# EAGLE design dboard (EAGLE 9.6.2)
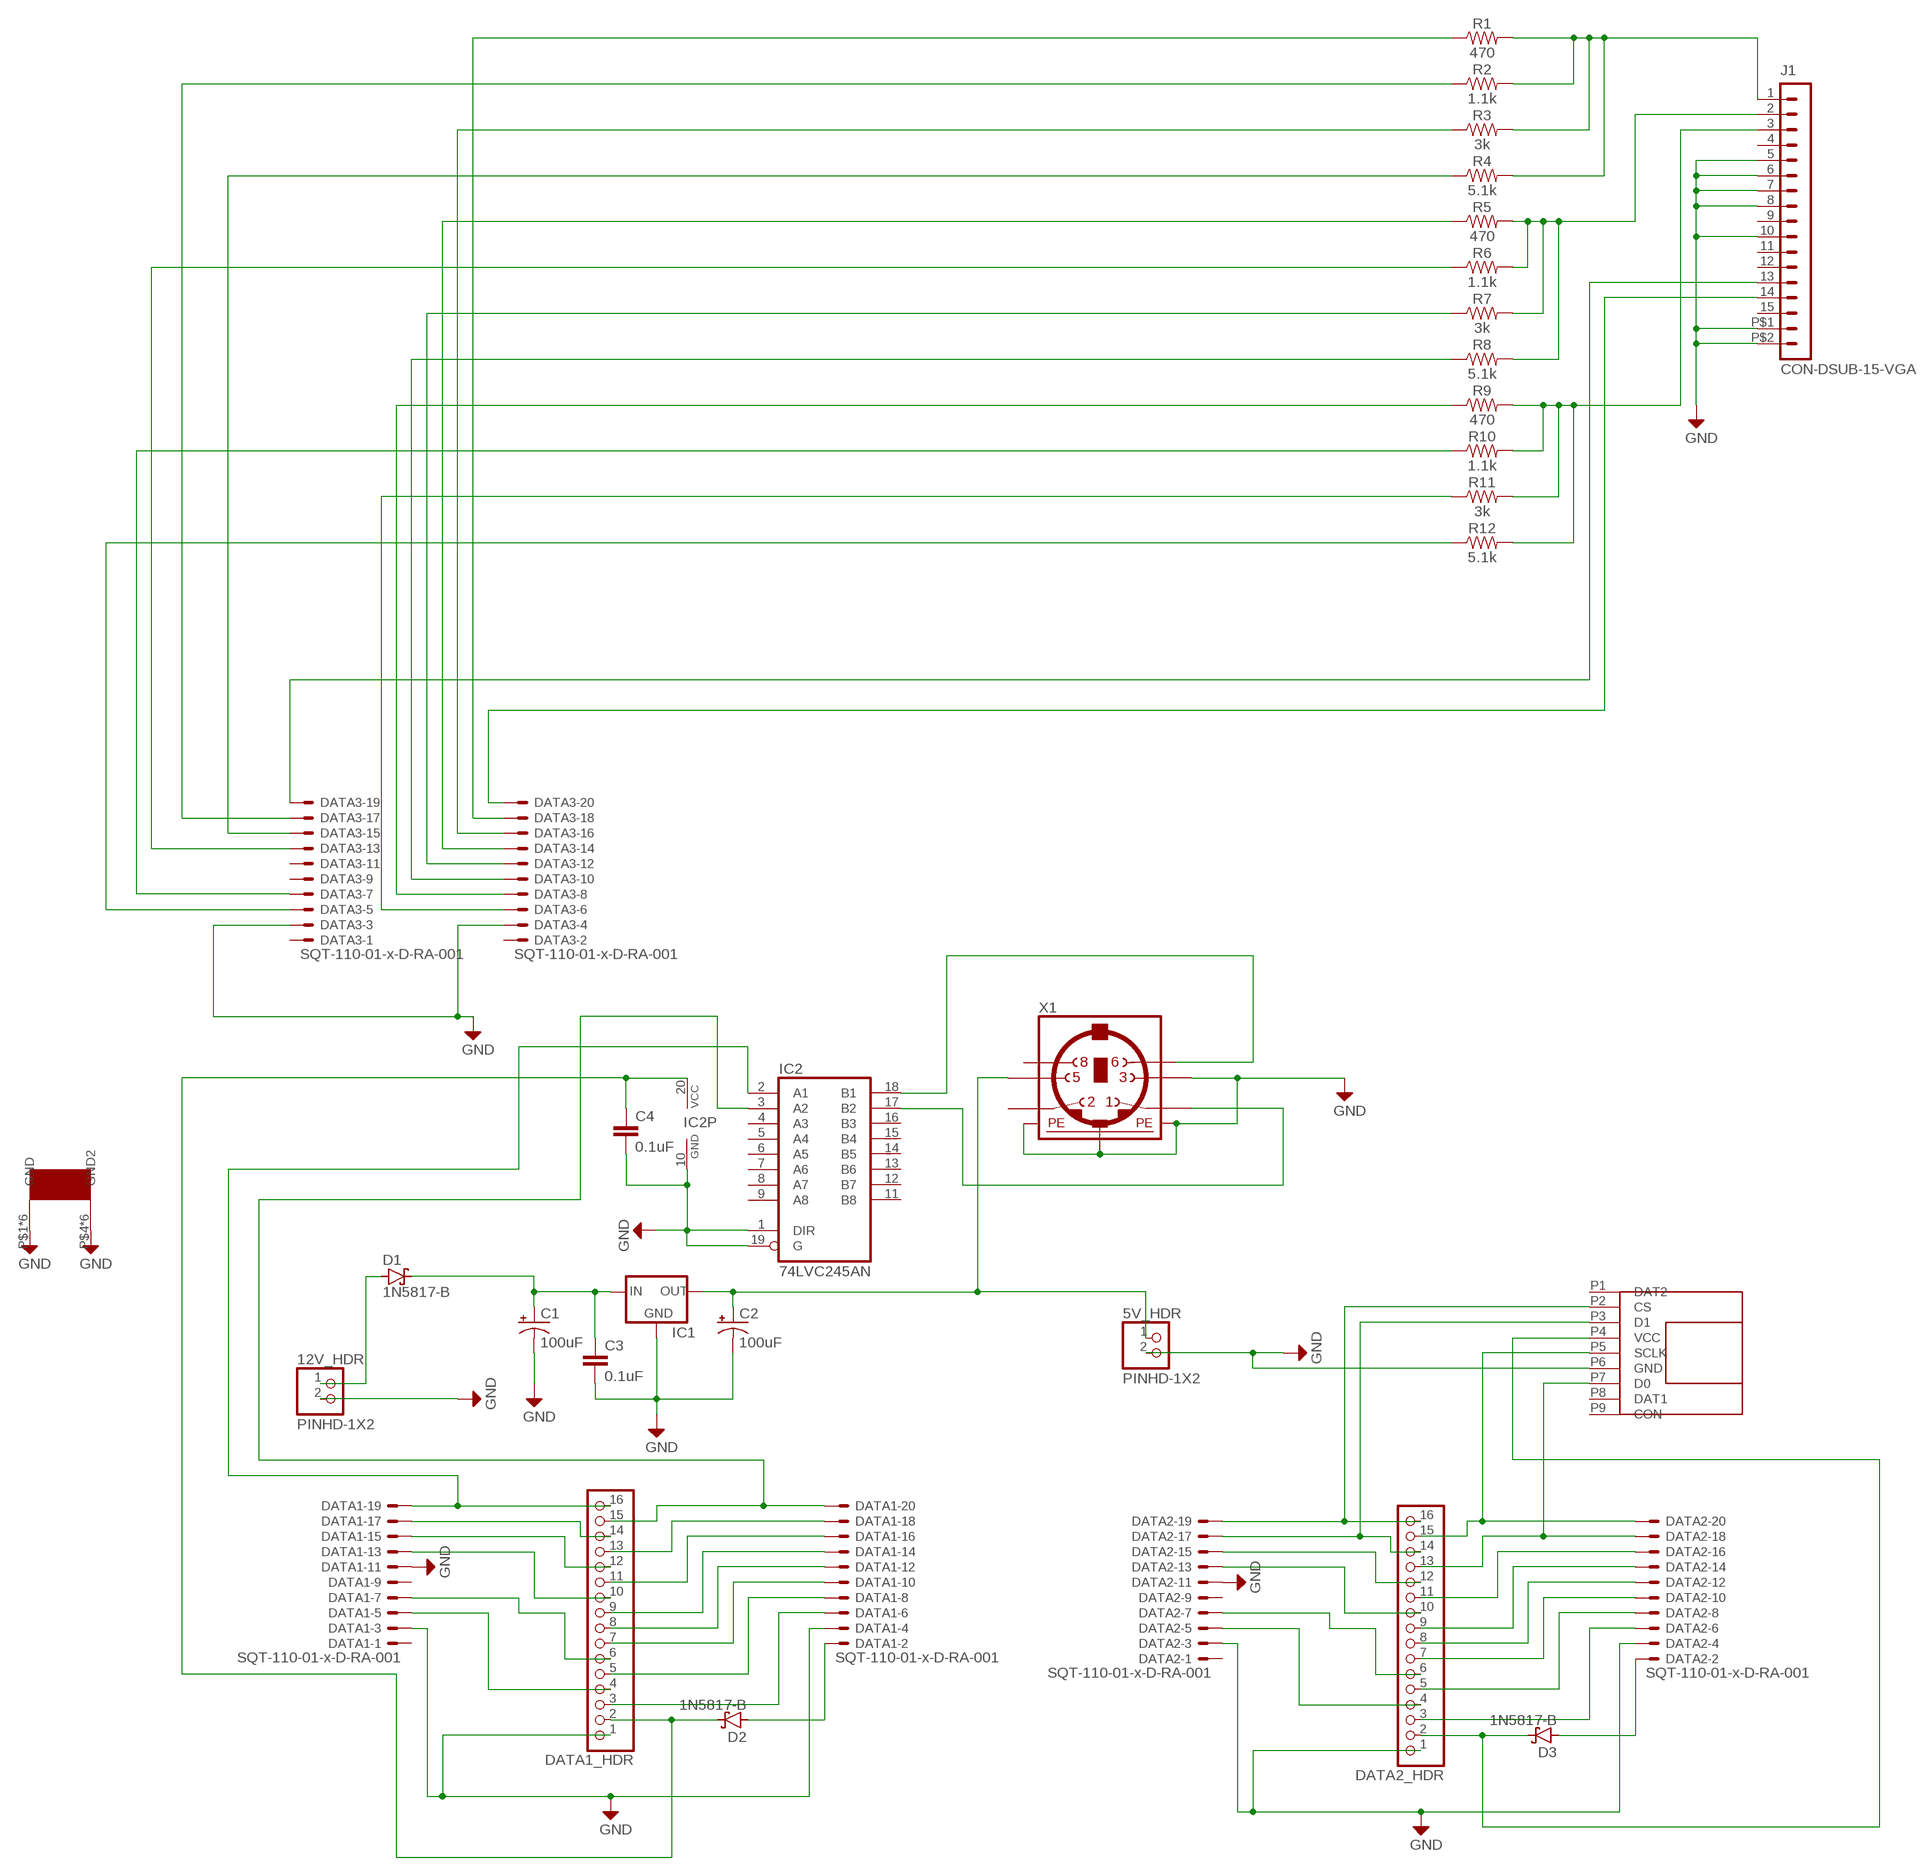
[diagram p0: schematic, sheet 1]

## Parts
5V_HDR  PINHD-1X2  [1X02]
12V_HDR  PINHD-1X2  [1X02]
C1  100uF  100UF-POLAR-RADIAL-2.5MM-25V-20%  [CPOL-RADIAL-2.5MM-6.5MM]
C2  100uF  100UF-POLAR-RADIAL-2.5MM-25V-20%  [CPOL-RADIAL-2.5MM-6.5MM]
C3  0.1uF  0.1UF-KIT-EZ-50V-20%  [CAP-PTH-SMALL-KIT]
C4  0.1uF  0.1UF-KIT-EZ-50V-20%  [CAP-PTH-SMALL-KIT]
D1  1N5817-B  [DO41-7.6]
D2  1N5817-B  [DO41-7.6]
D3  1N5817-B  [DO41-7.6]
DATA1  SQT-110-01-x-D-RA-001  332-20  [332-20]
DATA1_HDR  PINHD-1X16  [1X16]
DATA2  SQT-110-01-x-D-RA-001  332-20  [332-20]
DATA2_HDR  PINHD-1X16  [1X16]
DATA3  SQT-110-01-x-D-RA-001  332-20  [332-20]
IC1  78XXL  [78XXL]
IC2  74LVC245AN  74LS245N  [DIL20]
J1  CON-DSUB-15-VGA  [181-015-212-171]
R1  470  RESISTORAXIAL-0.3  [AXIAL-0.3]
R2  1.1k  RESISTORAXIAL-0.3  [AXIAL-0.3]
R3  3k  RESISTORAXIAL-0.3  [AXIAL-0.3]
R4  5.1k  RESISTORAXIAL-0.3  [AXIAL-0.3]
R5  470  RESISTORAXIAL-0.3  [AXIAL-0.3]
R6  1.1k  RESISTORAXIAL-0.3  [AXIAL-0.3]
R7  3k  RESISTORAXIAL-0.3  [AXIAL-0.3]
R8  5.1k  RESISTORAXIAL-0.3  [AXIAL-0.3]
R9  470  RESISTORAXIAL-0.3  [AXIAL-0.3]
R10  1.1k  RESISTORAXIAL-0.3  [AXIAL-0.3]
R11  3k  RESISTORAXIAL-0.3  [AXIAL-0.3]
R12  5.1k  RESISTORAXIAL-0.3  [AXIAL-0.3]
U$1  7085THERMALPAD  [7805THERMALPAD]
U$2  TF_CARD_BREAKOUT  OPEN-SMARTTFCARDBREAKOUT  [OPEN-SMARTTFCARDBREAKOUT]
X1  MINI_DIN_6  [M_DIN6]

## Nets
A20: DATA1.6 DATA1_HDR.3
B19: DATA1.8 DATA1_HDR.5
B20: DATA1.7 DATA1_HDR.6
C20: DATA1.10 DATA1_HDR.7
D18: DATA1.13 DATA1_HDR.10
D19: DATA1.15 DATA1_HDR.12
D20: DATA1.14 DATA1_HDR.9
DATA1_33V: D2.A DATA1.2
DATA2_33V: D3.A DATA2.2
E19: DATA1.17 DATA1_HDR.14
F19: DATA1.20 DATA1_HDR.15 IC2.3(A2)
F20: DATA1.18 DATA1_HDR.13
G19: DATA2.8 DATA2_HDR.5
G20: DATA2.6 DATA2_HDR.3
GND: 5V_HDR.2 12V_HDR.2 C1.2(-) C2.2(-) C3.2 C4.2 DATA1.3 DATA1.4 DATA1.11 DATA1_HDR.1 DATA2.3 DATA2.4 DATA2.11 DATA2_HDR.1 DATA3.3 DATA3.4 IC1.GND IC2.1(DIR) IC2.10(GND) IC2.19(G) J1.5 J1.6 J1.7 J1.8 J1.10 J1.P$1 J1.P$2 U$1.P$1(GND) U$1.P$4(GND2) U$1.P$6(GND) U$1.P$7(GND) U$1.P$8(GND) U$1.P$9(GND) U$1.P$10(GND) U$1.P$11(GND2) U$1.P$14(GND2) U$1.P$19(GND2) U$1.P$21(GND2) U$1.P$24(GND2) U$2.P6(GND) X1.3 X1.SH1(PE1) X1.SH2(PE2) X1.SH3(PE3)
H16: DATA1.5 DATA1_HDR.4
H17: DATA1.12 DATA1_HDR.8
H18: DATA1.16 DATA1_HDR.11
H20: DATA2.7 DATA2_HDR.6
HSYNC: DATA3.19 J1.13
J18: DATA2.5 DATA2_HDR.4
J19: DATA2.10 DATA2_HDR.7
J20: DATA2.13 DATA2_HDR.10
K17: DATA1.19 DATA1_HDR.16 IC2.2(A1)
K18: DATA2.12 DATA2_HDR.8
K19: DATA2.14 DATA2_HDR.9
KBD_VCC: C4.1 D2.C DATA1_HDR.2 IC2.20(VCC)
L16: DATA2.16 DATA2_HDR.11
L19: DATA2.15 DATA2_HDR.12
N$4: C1.1(+) C3.1 D1.C IC1.IN
PS2_CLK: IC2.18(B1) X1.6
PS2_DATA: IC2.17(B2) X1.1
SD_CS: DATA2.19 DATA2_HDR.16 U$2.P2(CS)
SD_MISO: DATA2.18 DATA2_HDR.13 U$2.P7(D0)
SD_MOSI: DATA2.17 DATA2_HDR.14 U$2.P3(D1)
SD_SCLK: DATA2.20 DATA2_HDR.15 U$2.P5(SCLK)
SD_VCC: D3.C DATA2_HDR.2 U$2.P4(VCC)
VCC+5V: 5V_HDR.1 C2.1(+) IC1.OUT X1.5
VGA_B0: DATA3.5 R12.P$1
VGA_B1: DATA3.6 R11.P$1
VGA_B2: DATA3.7 R10.P$1
VGA_B3: DATA3.8 R9.P$1
VGA_BLUE: J1.3 R9.P$2 R10.P$2 R11.P$2 R12.P$2
VGA_G0: DATA3.10 R8.P$1
VGA_G1: DATA3.12 R7.P$1
VGA_G2: DATA3.13 R6.P$1
VGA_G3: DATA3.14 R5.P$1
VGA_GREEN: J1.2 R5.P$2 R6.P$2 R7.P$2 R8.P$2
VGA_R0: DATA3.15 R4.P$1
VGA_R1: DATA3.16 R3.P$1
VGA_R2: DATA3.17 R2.P$1
VGA_R3: DATA3.18 R1.P$1
VGA_RED: J1.1 R1.P$2 R2.P$2 R3.P$2 R4.P$2
VIN_12V: 12V_HDR.1 D1.A
VSYNC: DATA3.20 J1.14
Unconnected: DATA1.1 DATA1.9 DATA2.1 DATA2.9 DATA3.1 DATA3.2 DATA3.9 DATA3.11 IC2.4(A3) IC2.5(A4) IC2.6(A5) IC2.7(A6) IC2.8(A7) IC2.9(A8) IC2.11(B8) IC2.12(B7) IC2.13(B6) IC2.14(B5) IC2.15(B4) IC2.16(B3) J1.4 J1.9 J1.11 J1.12 J1.15 U$2.P1(DAT2) U$2.P8(DAT1) U$2.P9(CON) X1.2 X1.8

## Library data of the parts
5V_HDR 12V_HDR = Connector:PINHD-1X2: PIN HEADER; CATEGORY: CONNECTOR; SUB-CATEGORY: PIN-HEADER
C1 C2 = SparkFun-Capacitors:100UF-POLAR: 100µF polarized capacitors A capacitor is a passive two-terminal electrical component used to store electrical energy temporarily in an electric field.; PROD_ID: CAP-08439
C3 C4 = SparkFun-Capacitors:0.1UF: 0.1µF ceramic capacitors A capacitor is a passive two-terminal electrical component used to store electrical energy temporarily in an electric field.; PROD_ID: CAP-08370
D1-D3 = diode:1N581*: 1.0A SCHOTTKY BARRIER RECTIFIER Source: http://www.diodes.com/datasheets/ds23001.pdf
DATA1-DATA3 = con-garry:332-20: 20 Pin - 2mm Dual Row Source: www.mpe-connector.de / garry_shortform_2012.pdf
DATA1_HDR DATA2_HDR = pinhead:PINHD-1X16: PIN HEADER
IC1 = v-reg:78XXL: VOLTAGE REGULATOR
IC2 = 74xx-eu:74*245: Octal BUS TRANSCEIVER, 3-state
J1 = m-pad-2.1:CON-DSUB-15-VGA: NORCOMP's High Density 90° PC Mount D-Sub Connector 181 Series: SPECIFICATIONS: Contact Rating: 5 Amps Dielectric Strength: 1000V AC RMS Insulation Resistance: 1000 meg ohms Contact Material: Phosphor Bronze Contact Finish: Gold flash over Nickel Operating Temperature: -55°C to 150°C Shell Material: Steel, Tin Plated Insulations Material: Glass-Filled Polyester (UL94V-0) Gender: Receptacle (female) Please send any comments to: messi@users.sourceforge.net
R1-R12 = SparkFun-Resistors:RESISTOR: Generic Resistor Package
U$1 = my-library:7085THERMALPAD
U$2 = my-library:OPEN-SMARTTFCARDBREAKOUT
X1 = mini_din:MINI_DIN_6

## Board
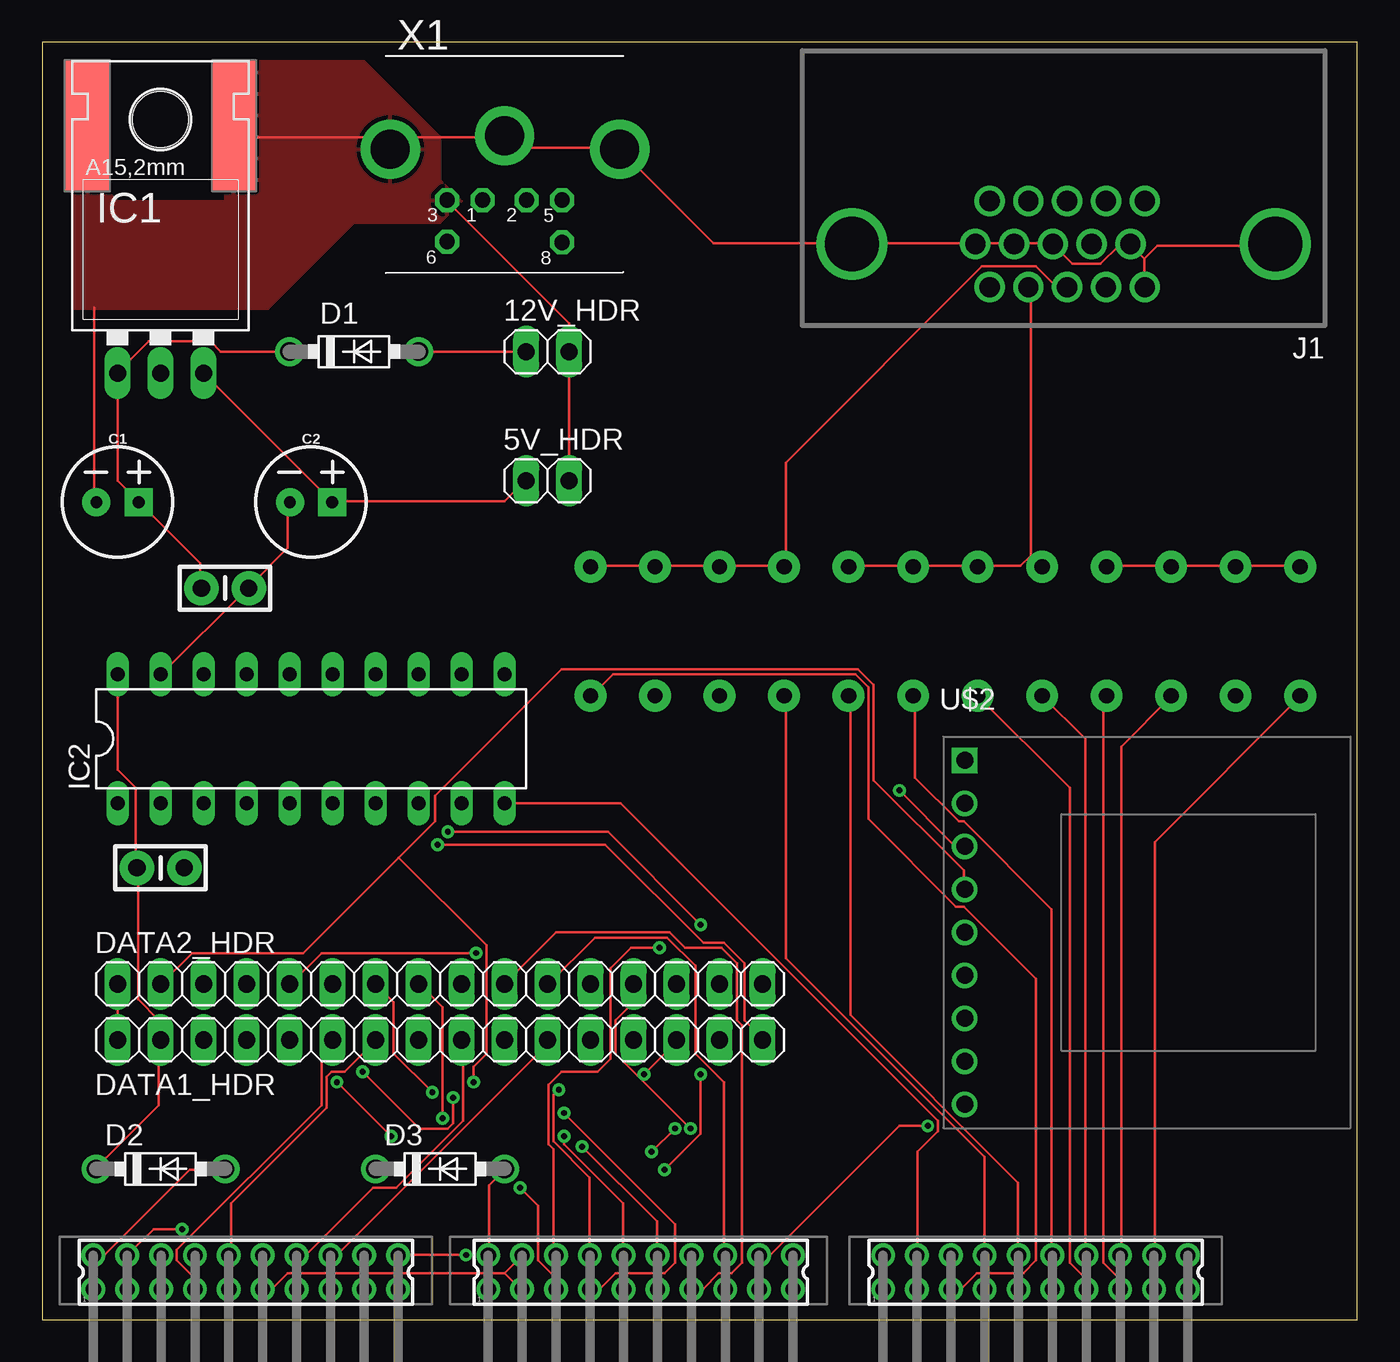
[diagram p1: board, top side]
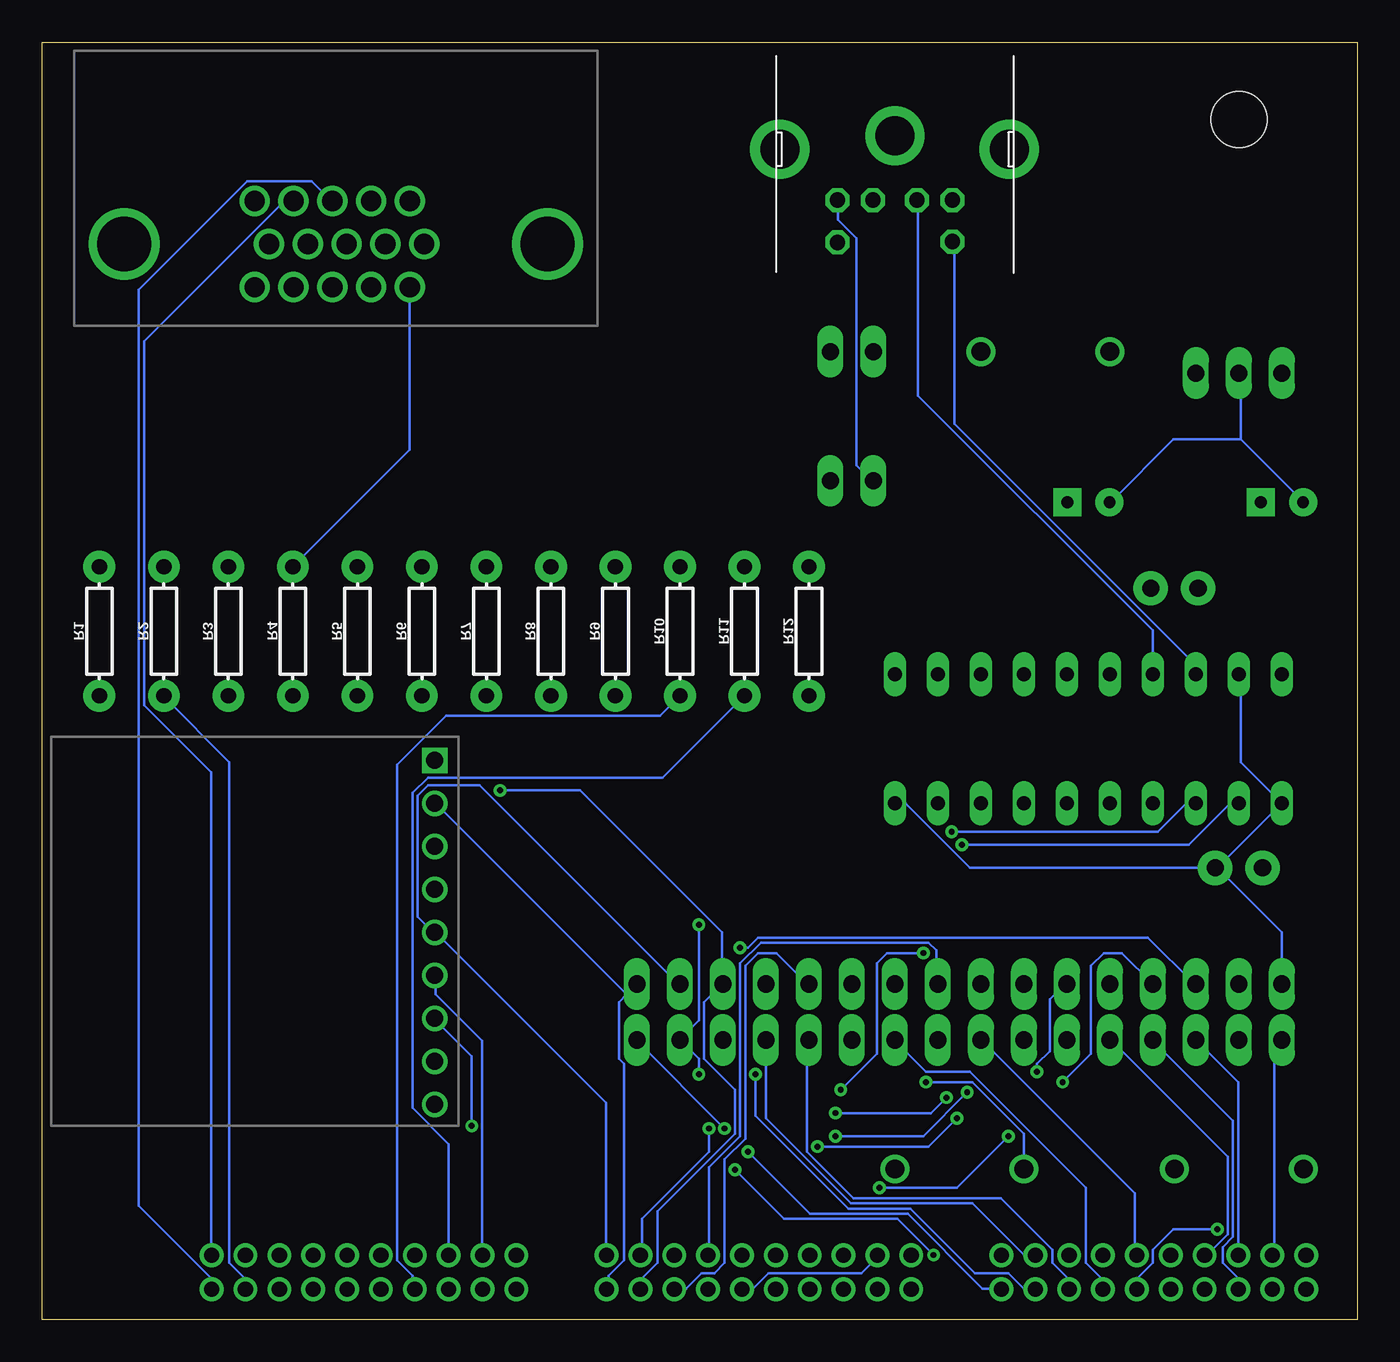
[diagram p2: board, bottom side, seen from below]

Size 77.66 x 75.41 mm. Coordinates in mm from the lower left corner, seen from the top.
Outline: 0,0 77.67,0 77.67,75.41 0,75.41 0,0
Copper layers (1*16): Top 0.035mm / dielectric 1.5mm / Bottom 0.035mm
Design rules "default": minimum track width 6mil, minimum drill 0.35mm, track to track 6mil, track to pad 6mil, pad to pad 6mil, via to via 6mil, smd to smd 6mil, copper to edge 40mil, drill to drill 6mil, minimum pad ring 10mil, minimum via ring 8mil, stop-mask expansion 4mil, vias tented up to drill 0mil, thermal gap 10mil

### Footprints (pad centres in the part's own frame; a part is rotated, then mirrored left to right if it is on the bottom)
1X02 = drill 1.016 long: 1 -1.27,0; 2 1.27,0
CPOL-RADIAL-2.5MM-6.5MM = drill 0.7 pad 1.651 square: 1 1.25,0 | drill 0.7 pad 1.651: 2 -1.25,0
CAP-PTH-SMALL-KIT = drill 1.016 pad 2.032: 1 -1.397,0; 2 1.397,0
DO41-7.6 = drill 1.1 pad 1.7: A 3.81,0; C -3.81,0
332-20 = drill 0.9 pad 1.27: 1 -9,-1; 2 -9,1; 3 -7,-1; 4 -7,1; 5 -5,-1; 6 -5,1; 7 -3,-1; 8 -3,1; 9 -1,-1; 10 -1,1; 11 1,-1; 12 1,1; 13 3,-1; 14 3,1; 15 5,-1; 16 5,1; 17 7,-1; 18 7,1; 19 9,-1; 20 9,1
1X16 = drill 1.016 long: 1 -19.05,0; 2 -16.51,0; 3 -13.97,0; 4 -11.43,0; 5 -8.89,0; 6 -6.35,0; 7 -3.81,0; 8 -1.27,0; 9 1.27,0; 10 3.81,0; 11 6.35,0; 12 8.89,0; 13 11.43,0; 14 13.97,0; 15 16.51,0; 16 19.05,0
78XXL = drill 1.016 long: GND 0,-3.81; IN -2.54,-3.81; OUT 2.54,-3.81 | hole 3.302: 0,11.176
DIL20 = drill 0.813 long: 1 -11.43,-3.81; 2 -8.89,-3.81; 3 -6.35,-3.81; 4 -3.81,-3.81; 5 -1.27,-3.81; 6 1.27,-3.81; 7 3.81,-3.81; 8 6.35,-3.81; 9 8.89,-3.81; 10 11.43,-3.81; 11 11.43,3.81; 12 8.89,3.81; 13 6.35,3.81; 14 3.81,3.81; 15 1.27,3.81; 16 -1.27,3.81; 17 -3.81,3.81; 18 -6.35,3.81; 19 -8.89,3.81; 20 -11.43,3.81
181-015-212-171 = drill 1.194: 1 4.371,2.541; 2 2.08,2.541; 3 -0.211,2.541; 4 -2.502,2.541; 5 -4.793,2.541; 6 5.217,0; 7 2.926,0; 8 0.635,0; 9 -1.656,0; 10 -3.947,0; 11 4.371,-2.541; 12 2.08,-2.541; 13 -0.211,-2.541; 14 -2.502,-2.541; 15 -4.793,-2.541 | drill 3.2: P$1 -12.502,0; P$2 12.502,0
AXIAL-0.3 = drill 0.9 pad 1.88: P$1 -3.81,0; P$2 3.81,0
7805THERMALPAD = smd 2.54 x 1.27: P$1 -5.588,1.27; P$4 3.048,1.27; P$6 -5.588,0; P$7 -5.588,-1.27; P$8 -5.588,-2.54; P$9 -5.588,-3.81; P$10 -5.588,-5.08; P$11 3.048,-2.54; P$14 3.048,-1.27; P$19 3.048,0; P$21 3.048,-3.81; P$24 3.048,-5.08
OPEN-SMARTTFCARDBREAKOUT = drill 1 square: P1 5.08,10.16 | drill 1: P2 5.08,7.62; P3 5.08,5.08; P4 5.08,2.54; P5 5.08,0; P6 5.08,-2.54; P7 5.08,-5.08; P8 5.08,-7.62; P9 5.08,-10.16
M_DIN6 = drill 0.9 pad 1.422 octagon: 1 -1.3,-3.75; 2 1.3,-3.75; 3 -3.4,-3.75; 5 3.4,-3.75; 6 -3.4,-6.2; 8 3.4,-6.25 | drill 2.3 pad 3.5: SH1 6.8,-0.75; SH2 0,0.05; SH3 -6.75,-0.75

### Placement (x,y rotation side)
5V_HDR  29.84,49.53 0 top
12V_HDR  29.84,57.15 0 top
C1  4.44,48.26 0 top
C2  15.88,48.26 0 top
C3  10.8,43.18 0 top
C4  6.99,26.67 0 top
D1  18.41,57.15 0 top
D2  6.99,8.89 0 top
D3  23.5,8.89 0 top
DATA1  12.02,2.79 0 top
DATA1_HDR  23.5,16.51 0 top
DATA2  35.34,2.79 0 top
DATA2_HDR  23.5,19.81 0 top
DATA3  58.67,2.79 0 top
IC1  6.99,59.69 0 top
IC2  15.88,34.29 0 top
J1  60.33,63.5 180 top
R1  74.3,40.64 90 bottom
R2  70.48,40.64 90 bottom
R3  66.67,40.64 90 bottom
R4  62.86,40.64 90 bottom
R5  59.06,40.64 90 bottom
R6  55.24,40.64 90 bottom
R7  51.44,40.64 90 bottom
R8  47.62,40.64 90 bottom
R9  43.81,40.64 90 bottom
R10  40.01,40.64 90 bottom
R11  36.2,40.64 90 bottom
R12  32.38,40.64 90 bottom
U$1  8.25,72.39 0 top
U$2  49.4,22.86 0 top
X1  27.3,69.85 0 top

### Tracks (layer width: path | path; a pad name or v marks a point on that pad's centre or on a via)
A20
  Bottom 0.152: DATA1_HDR.3 7.04,14.02 7.04,3.81 DATA1.6
B19
  Bottom 0.152: DATA1.8 8.86,3.81 7.65,5.03 7.65,9.6 14.5,16.46 DATA1_HDR.5
B20
  Top 0.152: DATA1_HDR.6 16.48,15.85 16.48,12.65 7.95,4.12 7.95,3.5 8.86,2.59 8.86,1.83 DATA1.7
C20
  Top 0.152: DATA1.10 11.15,3.81 11.15,6.86 16.79,12.5 16.79,14.33 17.09,14.63 17.86,14.63 19.69,16.46 DATA1_HDR.7
D18
  Bottom 0.152: DATA1.13 15.11,1.83 15.11,2.44 16.03,3.35 16.03,7.77 22.89,14.63 25.48,14.63 27.3,16.46 DATA1_HDR.10
D19
  Bottom 0.152: DATA1.15 17.09,1.83 17.09,2.44 18.01,3.35 18.01,4.12 21.06,7.16 29.74,7.16 32.49,9.91 32.49,16.46 DATA1_HDR.12
D20
  Top 0.152: DATA1.14 15.11,3.81 15.57,3.81 19.53,7.77 20.9,7.77 24.87,11.73 24.87,16.46 DATA1_HDR.9
DATA1_33V
  Top 0.152: DATA1.2 3.07,3.81 3.68,3.81 8.71,8.84 10.69,8.84 D2.A
DATA2_33V
  Top 0.152: DATA2.2 26.39,3.81 26.39,7.92 27.3,8.84 D3.A
E19  (via drill 0.35)
  Top 0.152: v35.54,14.48 37.52,16.46 DATA1_HDR.14
  Bottom 0.152: v35.54,14.48 35.54,12.04 30.05,6.55 26.39,6.55 22.58,2.74 20.6,2.74 19.69,1.83 19.07,1.83 DATA1.17
F19  (via drill 0.35)
  Top 0.152: v23.95,28.8 33.4,28.8 v38.89,23.32 | v25.02,3.81 21.06,3.81 DATA1.20 | v36.75,8.84 38.89,10.97 v38.89,14.48
  Bottom 0.152: IC2.3 10.08,30.48 11.76,28.8 v23.95,28.8 | v38.89,23.32 38.89,17.68 39.95,16.61 DATA1_HDR.15 38.89,15.39 v38.89,14.48 | v25.02,3.81 27.15,5.94 33.86,5.94 v36.75,8.84
F20
  Bottom 0.152: DATA1_HDR.13 34.92,11.89 29.9,6.86 22.73,6.86 19.69,3.81 19.07,3.81 DATA1.18
G19  (via drill 0.35)
  Top 0.152: v30.51,13.56 30.2,13.26 30.2,10.52 32.33,8.38 32.33,3.81 DATA2.8 | v25.63,21.64 16.48,21.64 14.66,19.81 DATA2_HDR.5
  Bottom 0.152: v30.51,13.56 28.37,15.7 28.37,21.03 27.76,21.64 v25.63,21.64
G20  (via drill 0.35)
  Top 0.152: v36.45,21.95 34.77,21.95 33.55,20.73 33.55,15.39 32.79,14.63 30.66,14.63 29.9,13.87 29.9,10.36 30.2,10.06 30.2,3.81 DATA2.6
  Bottom 0.152: v36.45,21.95 35.99,21.95 35.38,22.55 12.37,22.55 9.63,19.81 DATA2_HDR.3
GND  (via drill 0.35)
  Top 0.152: 65.1,62.64 65.1,60.96 J1.5 | 65.1,62.64 64.34,63.4 J1.10 64.19,63.4 63.58,63.4 62.51,62.33 60.83,62.33 59.77,63.4 J1.8 59.61,63.55 57.48,63.55 J1.7 57.33,63.55 55.19,63.55 J1.6 55.04,63.55 47.88,63.55 J1.P$2 47.73,63.55 39.65,63.55 34.16,69.04 X1.SH1 34.01,69.19 27.91,69.19 27.3,69.8 | 65.1,62.64 65.86,63.4 72.72,63.4 J1.P$1 | 5V_HDR.2 12V_HDR.2 31.12,58.83 23.95,65.99 X1.3 | U$1.P$9 2.77,68.58 2.77,69.8 U$1.P$8 2.77,69.95 2.77,71.02 U$1.P$7 2.77,71.17 2.77,72.39 | 2.77,72.39 2.77,73.61 U$1.P$1 | 2.77,72.39 U$1.P$6 | 27.3,69.8 12.37,69.8 11.46,68.89 11.46,68.58 11.3,68.43 11.15,68.58 11.15,69.8 11.3,69.8 U$1.P$11 | 27.3,69.8 X1.SH2 | IC2.19 7.04,38.1 12.07,43.13 C3.2 12.22,43.28 14.5,45.57 14.5,48.16 C2.2 | 27.3,2.74 14.5,2.74 13.59,1.83 13.13,1.83 DATA1.11 | 27.3,2.74 28.22,3.66 DATA2.4 | 27.3,2.74 28.22,1.83 DATA2.3 | DATA3.3 51.69,1.83 51.69,3.66 DATA3.4 51.69,3.81 51.69,9.91 52.91,11.12 52.91,11.73 34.16,30.48 IC2.10 | DATA1.3 5.05,1.83 5.05,3.66 DATA1.4 5.05,3.81 6.58,5.33 v8.25,5.33 | DATA2_HDR.1 DATA1_HDR.1 | 3.07,59.74 3.07,48.31 C1.2
  Bottom 0.152: 6.88,51.97 6.88,55.78 IC1.GND | 6.88,51.97 3.23,48.31 C1.2 | 6.88,51.97 10.85,51.97 14.5,48.31 C2.2 | DATA2.11 36.3,1.83 35.69,1.83 34.77,2.74 29.29,2.74 28.37,3.66 DATA2.4 | U$2.P6 54.43,20.27 54.43,19.2 51.69,16.46 51.69,3.81 DATA3.4 | DATA1.4 4.9,3.81 4.9,16 4.44,16.46 DATA1_HDR.1 | 8.25,26.67 IC2.1 6.88,32.92 6.88,38.1 IC2.19 | IC2.10 26.7,30.48 22.89,26.67 C4.2 8.25,26.67 | DATA2_HDR.1 4.44,22.86 8.25,26.67 | v8.25,5.33 10.85,5.33 12.07,4.12 12.07,3.35 12.98,2.44 12.98,1.83 DATA1.11
  pour Top: 10.8,74.93 18.41,74.93 23.5,69.85 23.5,67.31 24.77,66.04 23.5,64.77 18.41,64.77 13.34,59.69 12.07,59.69 10.8,60.96
  pour Top: 1.91,59.69 13.34,59.69 13.34,67.31 12.07,66.04 4.44,66.04 3.17,67.31 3.17,68.58 1.91,68.58
H16
  Bottom 0.152: DATA1.5 7.04,1.83 7.04,2.44 7.95,3.35 7.95,4.27 7.34,4.88 7.34,11.73 12.07,16.46 DATA1_HDR.4
H17
  Bottom 0.152: DATA1.12 13.13,3.81 13.13,7.47 22.12,16.46 DATA1_HDR.8
H18
  Top 0.152: DATA1.16 17.09,3.81 17.4,3.81 29.74,16.15 29.74,16.46 DATA1_HDR.11
H20  (via drill 0.35)
  Top 0.152: v30.81,12.19 37.36,5.64 37.36,3.35 36.75,2.74 33.86,2.74 32.94,1.83 32.49,1.83 DATA2.7 | v24.26,13.11 24.26,11.58 23.95,11.28 22.28,11.28 v18.92,14.63
  Bottom 0.152: v30.81,12.19 25.17,12.19 v24.26,13.11 | v18.92,14.63 18.92,15.09 18.16,15.85 18.16,18.9 17.25,19.81 DATA2_HDR.6
HSYNC
  Bottom 0.152: DATA3.19 67.69,1.83 67.69,2.44 71.96,6.71 71.96,60.81 65.56,67.21 61.75,67.21 60.68,66.14 J1.13
J18  (via drill 0.35)
  Top 0.152: v28.22,7.77 29.29,6.71 29.29,3.5 30.2,2.59 30.2,1.83 DATA2.5 | v17.4,14.02 v20.6,10.82
  Bottom 0.152: v28.22,7.77 23.65,7.77 v20.6,10.82 | v17.4,14.02 15.72,15.7 15.72,20.88 14.96,21.64 13.89,21.64 DATA2_HDR.4
J19  (via drill 0.35)
  Top 0.152: v30.81,10.82 30.81,10.36 34.31,6.86 34.31,3.81 DATA2.10 | v23.04,13.41 20.75,15.7 20.75,18.75 DATA2_HDR.7
  Bottom 0.152: v30.81,10.82 25.63,10.82 v23.04,13.41
J20
  Top 0.152: DATA2_HDR.10 30.35,22.86 37.06,22.86 37.97,21.95 40.11,21.95 41.02,21.03 41.02,17.68 41.33,17.37 41.33,3.35 40.72,2.74 39.95,2.74 39.04,1.83 38.43,1.83 DATA2.13
K17  (via drill 0.35)
  Top 0.152: v23.34,28.04 33.25,28.04 39.04,22.25 40.26,22.25 41.48,21.03 41.48,17.68 42.55,16.61 DATA1_HDR.16 | v37.36,11.28 v35.99,9.91
  Bottom 0.152: IC2.2 7.49,30.48 9.93,28.04 v23.34,28.04 | v35.99,9.91 32.33,6.25 26.54,6.25 22.12,1.83 21.06,1.83 DATA1.19 | v37.36,11.28 42.55,16.46 DATA1_HDR.16
K18  (via drill 0.35)
  Top 0.152: v31.88,10.21 36.3,5.79 36.3,3.81 DATA2.12 | v23.65,11.89 23.65,18.44 22.28,19.81 DATA2_HDR.8
  Bottom 0.152: v31.88,10.21 25.32,10.21 v23.65,11.89
K19
  Bottom 0.152: DATA2.14 38.28,3.81 38.28,8.99 36.45,10.82 36.45,21.03 35.23,22.25 25.32,22.25 24.87,21.79 24.87,19.81 DATA2_HDR.9
KBD_VCC
  Top 0.152: D2.C 3.23,8.99 6.88,12.65 6.88,16.46 DATA1_HDR.2 6.88,16.61 6.88,17.68 5.66,18.9 5.66,26.67 C4.1 5.51,26.67 5.51,31.39 4.44,32.46 IC2.20
L16
  Top 0.152: DATA2.16 40.26,3.81 40.26,14.02 38.58,15.7 38.58,20.88 36.91,22.55 32.64,22.55 29.9,19.81 DATA2_HDR.11
L19
  Bottom 0.152: DATA2.15 40.26,1.83 39.65,1.83 38.73,2.74 37.97,2.74 37.36,3.35 37.36,9.45 36.14,10.67 36.14,20.88 35.38,21.64 34.31,21.64 32.49,19.81 DATA2_HDR.12
N$4
  Top 0.152: D1.C 10.54,57.15 9.93,57.76 6.27,57.76 4.44,55.93 IC1.IN 4.44,49.53 5.66,48.31 C1.1 5.82,48.16 9.32,44.65 9.32,43.28 C3.1
PS2_CLK
  Bottom 0.152: IC2.18 9.63,38.1 9.63,38.71 23.8,52.88 23.8,63.55 X1.6
PS2_DATA
  Bottom 0.152: IC2.17 12.07,40.69 25.93,54.56 25.93,65.99 X1.1
SD_CS
  Bottom 0.152: 43.16,19.2 43.61,18.75 43.61,15.39 43.31,15.09 43.31,3.5 44.22,2.59 44.22,1.83 DATA2.19 | 43.16,19.2 54.43,30.48 U$2.P2 | 43.16,19.2 DATA2_HDR.16
SD_MISO  (via drill 0.35)
  Top 0.152: v52.3,11.43 50.62,11.43 43,3.81 42.39,3.81 DATA2.18 | DATA2_HDR.13 34.92,18.75 33.86,17.68 33.86,15.7 v38.28,11.28
  Bottom 0.152: v52.3,11.43 52.3,15.54 54.43,17.68 U$2.P7 | v38.28,11.28 38.28,9.91 42.24,5.94 42.24,3.81 DATA2.18
SD_MOSI  (via drill 0.35)
  Top 0.152: v50.62,31.24 53.82,28.04 54.43,28.04 U$2.P3
  Bottom 0.152: 37.52,19.81 38.58,18.75 38.58,15.39 36.75,13.56 36.75,10.97 41.33,6.4 41.33,3.35 42.24,2.44 42.24,1.83 DATA2.17 | v50.62,31.24 45.9,31.24 37.52,22.86 37.52,19.81 | 37.52,19.81 DATA2_HDR.14
SD_SCLK
  Bottom 0.152: DATA2.20 44.37,3.81 44.37,12.8 54.43,22.86 U$2.P5 54.59,22.86 55.5,23.77 55.5,30.94 54.89,31.55 51.84,31.55 40.11,19.81 DATA2_HDR.15
SD_VCC  (via drill 0.35)
  Top 0.152: 21.06,27.28 15.42,21.64 8.86,21.64 7.04,19.81 DATA2_HDR.2 | 21.06,27.28 23.19,29.41 23.19,30.94 30.66,38.41 48.18,38.41 49.1,37.49 49.1,31.85 54.43,26.52 54.43,25.45 U$2.P4 | v25.48,14.02 25.48,14.94 26.24,15.7 26.24,22.1 21.06,27.28
  Bottom 0.152: D3.C 19.69,10.97 22.73,14.02 v25.48,14.02
VCC+5V
  Top 0.152: IC1.OUT 17.09,48.31 C2.1 17.25,48.31 27.3,48.31 28.52,49.53 5V_HDR.1
  Bottom 0.152: X1.5 30.66,65.99 30.66,64.92 29.59,63.86 29.59,50.44 28.68,49.53 5V_HDR.1
VGA_B0
  Top 0.152: DATA3.5 53.67,1.83 54.28,1.83 55.19,2.74 57.94,2.74 58.7,3.5 58.7,20.12 54.43,24.38 53.98,24.38 48.79,29.57 48.79,37.34 48.03,38.1 33.71,38.1 32.49,36.88 R12.P$1
VGA_B1
  Bottom 0.152: R11.P$1 41.02,32 54.89,32 55.8,31.09 55.8,12.5 53.67,10.36 53.67,3.81 DATA3.6
VGA_B2
  Bottom 0.152: R10.P$1 41.17,35.66 53.82,35.66 56.72,32.77 56.72,3.5 55.8,2.59 55.8,1.83 DATA3.7
VGA_B3
  Top 0.152: DATA3.8 55.65,3.81 55.65,9.6 43.92,21.34 43.92,36.73 R9.P$1
VGA_BLUE
  Top 0.152: R12.P$2 32.49,44.5 36.14,44.5 R11.P$2 36.3,44.5 39.95,44.5 R10.P$2 40.11,44.5 43.76,44.5 R9.P$2 43.92,44.5 43.92,50.6 55.5,62.18 58.7,62.18 59.92,60.96 J1.3
VGA_G0
  Top 0.152: DATA3.10 57.63,3.81 57.63,8.08 47.73,17.98 47.73,36.73 R8.P$1
VGA_G1
  Top 0.152: DATA3.12 59.61,3.81 59.61,24.23 54.43,29.41 54.13,29.41 51.54,32 51.54,36.73 R7.P$1
VGA_G2
  Top 0.152: R6.P$1 60.68,31.39 60.68,3.35 61.59,2.44 61.59,1.83 DATA3.13
VGA_G3
  Top 0.152: R5.P$1 61.59,34.29 61.59,3.81 DATA3.14
VGA_GREEN
  Top 0.152: R8.P$2 47.73,44.5 51.38,44.5 R7.P$2 51.54,44.5 55.19,44.5 R6.P$2 55.35,44.5 57.78,44.5 58.39,45.11 | 58.39,45.11 58.39,60.81 J1.2 | R5.P$2 58.39,45.11
VGA_R0
  Top 0.152: DATA3.15 63.58,1.83 63.58,2.44 62.66,3.35 62.66,36.58 62.81,36.73 R4.P$1
VGA_R1
  Top 0.152: DATA3.16 63.73,3.81 63.73,33.83 66.62,36.73 R3.P$1
VGA_R2
  Bottom 0.152: DATA3.17 65.71,1.83 65.71,2.44 66.62,3.35 66.62,32.92 70.43,36.73 R2.P$1
VGA_R3
  Top 0.152: DATA3.18 65.71,3.81 65.71,28.19 74.24,36.73 R1.P$1
VGA_RED
  Top 0.152: R1.P$2 74.24,44.5 70.59,44.5 R2.P$2 70.43,44.5 66.78,44.5 R3.P$2 66.62,44.5 62.97,44.5 R4.P$2
  Bottom 0.152: R4.P$2 55.96,51.36 55.96,60.81 J1.1
VIN_12V
  Top 0.152: D1.A 12V_HDR.1
VSYNC
  Bottom 0.152: DATA3.20 67.69,3.81 67.69,32.31 71.65,36.27 71.65,57.76 63.42,65.99 62.97,65.99 J1.14

### Text on the board
tValues: 0.1uf | 0.1uf
bDocu: - | + | + | - | EBAZ4205 / VGA/PS2 / Breakout Board / V2.0 | DATA1 | DATA2 | DATA3